# Altium schematic sheet POE_Sheet.SchDoc
size A3
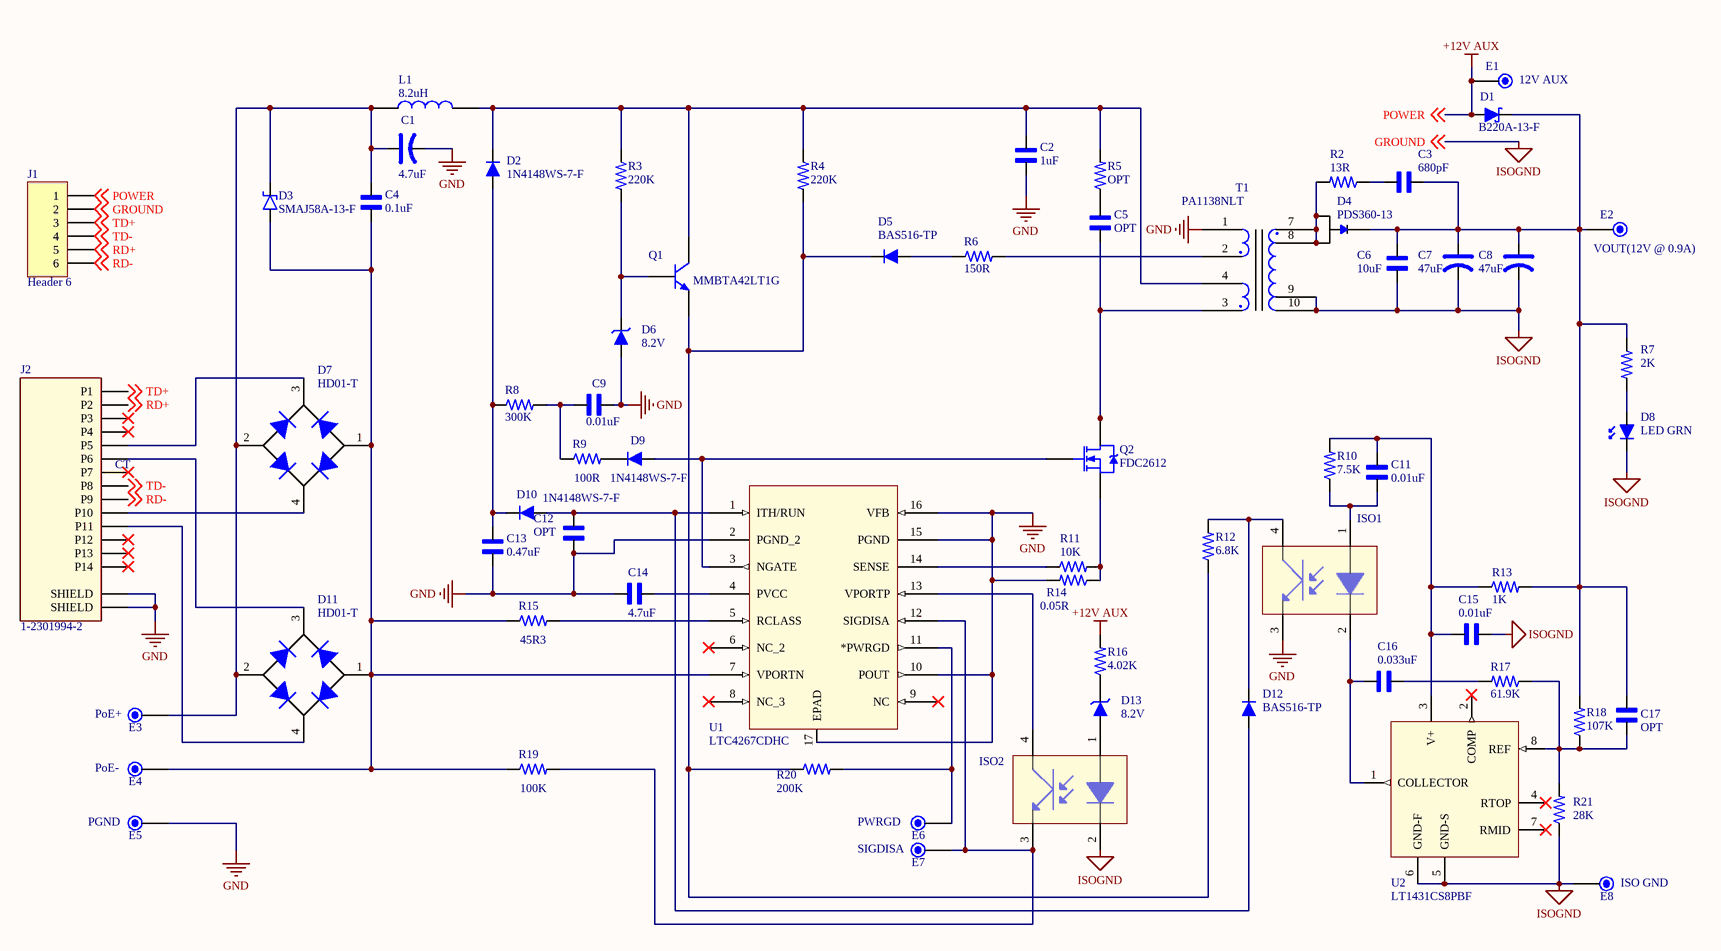
[diagram p0: POE_Sheet.SchDoc]

## Parts
C1  value 4.7uF  [CAPAE5953X52M]  (hidden comment: EMVA630ADA4R7ME55G)
C2  value 1uF  [*CAPC1005X55N]  (hidden comment: JMK105C6105KV-F)
C3  value 680pF  [*CAPC1005X55N]  (hidden comment: CC0402KRX7R9BB681)
C4  value 0.1uF  [*CAPC1005X55N]  (hidden comment: GRM155R71H104KE14J)
C5  OPT  [*CAPC1005X55N]
C6  value 10uF  [*CAPC1005X55N]  (hidden comment: GRM155R60G106ME44D)
C7  value 47uF  [CAPM6032X22N]  (hidden comment: TPSC476K016R0350)
C8  value 47uF  [CAPM6032X22N]  (hidden comment: TPSC476K016R0350)
C9  value 0.01uF  [*CAPC1005X55N]  (hidden comment: GRM155R61E103KA01D)
C11  value 0.01uF  [*CAPC1005X55N]  (hidden comment: GRM155R61E103KA01D)
C12  OPT  [*CAPC1005X55N]
C13  value 0.47uF  [*CAPC1005X55N]  (hidden comment: GRM155R61H474KE11D)
C14  value 4.7uF  [*CAPC1005X55N]  (hidden comment: GRM155R60J475ME47D)
C15  value 0.01uF  [*CAPC1005X55N]  (hidden comment: GRM155R61E103KA01D)
C16  value 0.033uF  [*CAPC1005X55N]  (hidden comment: CC0402ZRY5V7BB333)
C17  OPT  [*CAPC1005X55N]
D1  B220A-13-F  [*SMA-DIODE]
D2  1N4148WS-7-F  [*SOD323_1N4148WS-7-F(Primary)]
D3  SMAJ58A-13-F  [SMAJ]
D4  PDS360-13  [*DIO_PDS360-13]
D5  BAS516-TP  [*SOD323_1N4148WS-7-F(Primary)]
D6  value 8.2V  [*SOD323_1N4148WS-7-F(Primary)]  (hidden comment: MM3Z8V2ST1G)
D7  HD01-T  [HD01-T]
D8  value LED GRN  [LED1210]  (hidden comment: APD3224ZGC-F01)
D9  1N4148WS-7-F  [*SOD323_1N4148WS-7-F(Primary)]
D10  1N4148WS-7-F  [*SOD323_1N4148WS-7-F(Primary)]
D11  HD01-T  [HD01-T]
D12  BAS516-TP  [*SOD323_1N4148WS-7-F(Primary)]
D13  value 8.2V  [*SOD323_1N4148WS-7-F(Primary)]  (hidden comment: MM3Z8V2ST1G)
E1  12V AUX  [E_PAD]
E2  VOUT(12V @ 0.9A)  [E_PAD]
E3  PoE+  [E_PAD]
E4  PoE-  [E_PAD]
E5  PGND  [E_PAD]
E6  PWRGD  [E_PAD]
E7  SIGDISA  [E_PAD]
E8  ISO GND  [E_PAD]
ISO1  PS2913-1-K-A  [SOic254P1016X440-4N]  (value not drawn)
ISO2  PS2913-1-K-A  [SOic254P1016X440-4N]  (value not drawn)
J1  Header 6  [HDR1X6]
J2  1-2301994-2  [*TE_1-2301994-2_1-2301994-2(Primary)]
L1  value 8.2uH  [INDP6866X23N]  (hidden comment: IHLP2525CZER8R2M01)
Q1  MMBTA42LT1G  [SOT-23-3(TO-236)]
Q2  FDC2612  [*SOT95P280X100-6N]
R2  value 13R  [RESC1005X40N]  (hidden comment: RC0402FR-0713RL)
R3  value 220K  [RESC1005X40N]  (hidden comment: CRGCQ0402F220K)
R4  value 220K  [RESC1005X40N]  (hidden comment: CRGCQ0402F220K)
R5  OPT  [RESC1005X40N]
R6  value 150R  [RESC1005X40N]  (hidden comment: RC0402FR-07150RL)
R7  value 2K  [RESC1005X40N]  (hidden comment: RC0402FR-072KL)
R8  value 300K  [RESC1005X40N]  (hidden comment: RN73R1ETTP3003B25)
R9  value 100R  [RESC1005X40N]  (hidden comment: RC0402FR-07100RL)
R10  value 7.5K  [RESC1005X40N]  (hidden comment: ERA-2AEB752X)
R11  value 10K  [RESC1005X40N]  (hidden comment: RC0402FR-0710KL)
R12  value 6.8K  [RESC1005X40N]  (hidden comment: ERA-2AED682X)
R13  value 1K  [RESC1005X40N]  (hidden comment: RC0402FR-071KL)
R14  value 0.05R  [RESC1005X40N]  (hidden comment: ERJ-2BWFR050X)
R15  value 45R3  [RESC1005X40N]  (hidden comment: RP73PF1E45R3BTD)
R16  value 4.02K  [RESC1005X40N]  (hidden comment: ERA-2AEB4021X)
R17  value 61.9K  [RESC1005X40N]  (hidden comment: RMCF0402FT61K9)
R18  value 107K  [RESC1005X40N]  (hidden comment: RP73PF1E107KBTD)
R19  value 100K  [RESC1005X40N]  (hidden comment: ERA-2AEB104X)
R20  value 200K  [RESC1005X40N]  (hidden comment: CPF0402B200KE)
R21  value 28K  [RESC1005X40N]  (hidden comment: ERA-2AEB2802X)
T1  PA1138NLT  [EP13T]
U1  LTC4267CDHC  [DFN-16_DHC]
U2  LT1431CS8PBF  [*SO-8_S]

## Nets
+12V AUX: D1.1(A) E1.1 J1.1 R16.2 ; off-sheet POWER  [also labelled POWER]
GND: C1.2 C2.2 C9.1 C12.2 C13.1 C14.1 D6.A E5.1 ISO1.3 J2.SH1(SHIELD) J2.SH2(SHIELD) R14.2 T1.1 U1.2(PGND_2) U1.10(POUT) U1.15(PGND) U1.16(VFB) U1.17(EPAD)
ISOGND: C6.1 C7.2 C8.2 C15.2 D8.K E8.1 ISO2.2 J1.2 R21.1 T1.9 T1.10 U2.5(GND-S) U2.6(GND-F) ; off-sheet GROUND  [also labelled GROUND]
RD+: J1.5 J2.P2 ; off-sheet RD+
RD-: J1.6 J2.P9 ; off-sheet RD-
TD+: J1.3 J2.P1 ; off-sheet TD+
TD-: J1.4 J2.P8 ; off-sheet TD-
NetC1_1: C1.1 C4.1 D3.A D7.2 D11.2 E3.1 L1.1
NetC2_1: C2.1 D2.C L1.2 Q1.1(C) R3.1 R4.1 R5.2 T1.4
NetC3_1: C3.1 R2.1
NetC3_2: C3.2 C6.2 C7.1 C8.1 C17.2 D1.2(C) D4.3(HEATSINK_CATHODE) E2.1 R7.1 R13.2 R18.2
NetC4_2: C4.2 D3.K D7.1 D11.1 E4.1 R15.1 R19.1 U1.7(VPORTN)
NetC5_1: C5.1 R5.1
NetC5_2: C5.2 Q2.1(D) Q2.2(D) Q2.5(D) Q2.6(D) T1.3
NetC9_2: C9.2 R8.2 R9.1
NetC11_1: C11.1 ISO1.1 R10.1
NetC11_2: C11.2 C15.1 R10.2 R13.1 U2.3(V+)
NetC12_1: C12.1 D10.A D12.A U1.1(ITH/RUN)
NetC13_2: C13.2 D2.A D10.C R8.1
NetC14_2: C14.2 U1.4(PVCC)
NetC16_1: C16.1 ISO1.2 U2.1(COLLECTOR)
NetC16_2: C16.2 R17.2
NetC17_1: C17.1 R17.1 R18.1 R21.2 U2.8(REF)
NetD4_1: D4.1(LEFT_PIN_ANODE) D4.2(RIGHT_PIN_ANODE) R2.2 T1.7 T1.8
NetD5_A: D5.A R6.1
NetD5_C: D5.C Q1.3(E) R4.2 R12.1 R20.1
NetD6_C: D6.C Q1.2(B) R3.2
NetD7_3: D7.3 J2.P5
NetD7_4: D7.4 J2.P10
NetD8_A: D8.A R7.2
NetD9_A: D9.A Q2.3(G) U1.3(NGATE)
NetD9_C: D9.C R9.2
NetD11_3: D11.3 J2.P6
NetD11_4: D11.4 J2.P11
NetD12_C: D12.C ISO1.4 R12.2
NetD13_A: D13.A ISO2.1
NetD13_C: D13.C R16.1
NetE6_1: E6.1 R20.2 U1.11(*PWRGD)
NetE7_1: E7.1 ISO2.3 R19.2 U1.12(SIGDISA)
NetISO2_4: ISO2.4 U1.13(VPORTP)
NetQ2_4: Q2.4(S) R11.2 R14.1
NetR6_2: R6.2 T1.2
NetR11_1: R11.1 U1.14(SENSE)
NetR15_2: R15.2 U1.5(RCLASS)

Not connected (* = marked no-connect by the designer): J2 P3* P4* P7* P12* P13* P14*; U1 6(NC_2)* 8(NC_3)* 9(NC)*; U2 2(COMP)* 4(RTOP)* 7(RMID)*

## Notes on the sheet
- (near J2) CT

## Library data of the parts
C1 = EMVA630ADA4R7ME55G: 4.7µF 63V Aluminum Electrolytic Capacitors Radial, Can - SMD 2000 Hrs @ 85°C; MF: United Chemi-Con; SnapEDA_Link: https://www.snapeda.com/parts/EMVA630ADA4R7ME55G/United%20Chemi-Con/view-part/?ref=search&t=EMVA630ADA4R7ME55G; MP: EMVA630ADA4R7ME55G; Availability: Unavailable
C2 = JMK105C6105KV-F: 1µF ±10% 6.3V Ceramic Capacitor X6S 0402 (1005 Metric); MF: Taiyo Yuden; SnapEDA_Link: https://www.snapeda.com/parts/JMK105C6105KV-F/Taiyo%20Yuden/view-part/?ref=search&t=JMK105C6105KV-F; MP: JMK105C6105KV-F; Availability: Unavailable; Digi-Key_Part_Number: 587-3381-2-ND; Digi-Key_Purchase_URL: https://www.digikey.com.au/product-detail/en/taiyo-yuden/JMK105C6105KV-F/587-3381-2-ND/4157224
C3 = CC0402KRX7R9BB681: 680pF ±10% 50V Ceramic Capacitor X7R 0402 (1005 Metric); MF: Yageo; SnapEDA_Link: https://www.snapeda.com/parts/CC0402KRX7R9BB681/Yageo/view-part/?ref=search&t=CC0402KRX7R9BB681; MP: CC0402KRX7R9BB681; Availability: Unavailable; Digi-Key Part Number: 311-1030-2-ND
C4 = GRM155R71H104KE14J: SMD Capacitor X7R(EIA) with Capacitance: 0.10uF Tol. 10%. Rated Voltage: 50Vdc; MF: Murata Electronics; SnapEDA_Link: https://www.snapeda.com/parts/GRM155R71H104KE14J/Murata%20Electronics%20North%20America/view-part/1836262/?ref=snap; MP: GRM155R71H104KE14J; Availability: Unavailable
C5 C12 C17 = OPT_C: SnapEDA_Link: *; Value: OPT; MF: *; MP: *; Availability: Unavailable
C6 = GRM155R60G106ME44D: 10µF ±20% 4V Ceramic Capacitor X5R 0402 (1005 Metric); MF: Murata Electronics; SnapEDA_Link: https://www.snapeda.com/parts/GRM155R60G106ME44D/Murata/view-part/?ref=search&t=GRM155R60G106ME44D; MP: GRM155R60G106ME44D; Availability: Unavailable; Digi-Key Part Number: 490-10693-2-ND
C7 C8 = TPSC476K016R0350: 47µF Molded Tantalum Capacitors 16V 2312 (6032 Metric) 350mOhm; MF: AVX Corporation; SnapEDA_Link: https://www.snapeda.com/parts/TPSC476K016R0350/AVX/view-part/?ref=search&t=TPSC476K016R0350#download-modal; MP: TPSC476K016R0350; Availability: Unavailable; Digi-Key Part Number: 478-1773-2-ND
C9 C11 C15 = GRM155R61E103KA01D: 0.01uF ±10% 25V Ceramic Capacitor X5R 0402 (1005 Metric); MF: Murata Electronics; SnapEDA_Link: https://www.snapeda.com/parts/GRM155R61E103KA01D/Murata%20Electronics/view-part/?ref=search&t=GRM155R61E103KA01D; MP: GRM155R61E103KA01D; Availability: Unavailable
C13 = GRM155R61H474KE11D: 0.47µF ±10% 50V Ceramic Capacitor X5R 0402 (1005 Metric); MF: Murata Electronics; SnapEDA_Link: https://www.snapeda.com/parts/GRM155R61H474KE11D/Murata%20Electronics/view-part/?ref=search&t=GRM155R61H474KE11D; MP: GRM155R61H474KE11D; Availability: Unavailable
C14 = GRM155R60J475ME47D: 4.7µF ±20% 6.3V Ceramic Capacitor X5R 0402 (1005 Metric); MF: Murata Electronics; SnapEDA_Link: https://www.snapeda.com/parts/GRM155R60J475ME47D/Murata/view-part/?ref=search&t=GRM155R60J475ME47D; MP: GRM155R60J475ME47D; Availability: Unavailable
C16 = CC0402ZRY5V7BB333: 0.033µF -20%, +80% 16V Ceramic Capacitor Y5V (F) 0402 (1005 Metric); MF: Yageo; SnapEDA_Link: https://www.snapeda.com/parts/CC0402ZRY5V7BB333/Yageo/view-part/?ref=search&t=CC0402ZRY5V7BB333; MP: CC0402ZRY5V7BB333; Availability: Unavailable; Digi-Key Part Number: 311-1044-2-ND
D1 = B220A-13-F: Diode Schottky 20V 2A Surface Mount SMA; MF: Diodes Incorporated; SnapEDA_Link: https://www.snapeda.com/parts/B220A-13-F/Diodes%20Inc./view-part/232956/?ref=snap; Value: *; Digi-Key Part Number: B220A-FDITR-ND; MP: B220A-13-F
D2 D9 D10 = 1N4148WS-7-F: Diode Standard 75V 150mA Surface Mount SOD-323; MF: Diodes Incorporated; SnapEDA_Link: https://www.snapeda.com/parts/1N4148WS-7-F/Multicomp/view-part/957937/?ref=snap; Value: 1N4148WS-7-F; Digi-Key Part Number: 1N4148WS-FDITR-ND; MP: 1N4148WS-7-F; Digi-Key_Purchase_URL: https://www.digikey.com.au/product-detail/en/diodes-incorporated/1N4148WS-7-F/1N4148WS-FDITR-ND/815127
D3 = SMAJ58A-13-F: 93.6V Clamp 4.3A Ipp Tvs Diode Surface Mount SMA; MF: Littelfuse Inc.; MP: SMAJ58A-13-F; Package: DO-214 Littelfuse; Price: None; Value: *; SnapEDA_Link: https://www.snapeda.com/parts/SMAJ58A/Littelfuse%20Inc./view-part/53813/?ref=snap; Availability: Unavailable
D5 D12 = BAS516-TP: Diode Standard 75V 250mA (DC) Surface Mount SOD-523; Value: BAS516; MF: Micro Commercial Co; SnapEDA_Link: https://www.snapeda.com/parts/BAS516/Nexperia%20USA/view-part/?ref=search&t=BAS516-TP; Digi-Key Part Number: BAS516-TPMSTR-ND; MP: BAS516-TP; Digi-Key_Purchase_URL: https://www.digikey.com.au/product-detail/en/micro-commercial-co/BAS516-TP/BAS516-TPMSTR-ND/7681805
D6 D13 = MM3Z8V2ST1G: Zener Diode 8.2V 300mW ±2% Surface Mount SOD-323; MF: ON Semiconductor; SnapEDA_Link: https://www.snapeda.com/parts/MM3Z8V2ST1G/ON%20Semiconductor/view-part/?ref=search&t=MM3Z8V2ST1G; Digi-Key_Part_Number: MM3Z8V2ST1GOSTR-ND; Digi-Key_Purchase_URL: https://www.digikey.com.au/product-detail/en/on-semiconductor/MM3Z8V2ST1G/MM3Z8V2ST1GOSTR-ND/661874; MP: MM3Z8V2ST1G
D7 D11 = HD01-T: Bridge Rectifier Single Phase Standard 100V Surface Mount 4-MiniDIP; MF: Diodes Incorporated; Availability: Unavailable; MP: HD01-T; Package: None; Price: None; SnapEDA_Link: https://www.snapeda.com/parts/HD01-T/Diodes%20Inc./view-part/?ref=search&t=HD01-T; Value: *
D8 = APD3224ZGC-F01: Green 525nm LED Indication - Discrete 3.3V 1210 (3225 Metric); MF: Kingbright; Package: None; MP: APD3224ZGC-F01; Digi-Key_Part_Number: 754-1089-2-ND; SnapEDA_Link: https://www.snapeda.com/parts/APD3224ZGC-F01/Kingbright/view-part/?ref=search&t=APD3224ZGC-F01; Digi-Key_Purchase_URL: https://www.digikey.com.au/product-detail/en/kingbright/APD3224ZGC-F01/754-1089-2-ND/1747487
E1-E8 = E_PAD
ISO1 ISO2 = PS2913-1-K-A: Optoisolator Transistor Output 2500Vrms 1 Channel 4-Mini-Flat; MF: CEL; Value: 8.2uH; Digi-Key_Part_Number: PS2913-1-K-A-ND; MP: PS2913-1-K-A; Digi-Key_Purchase_URL: https://www.digikey.com.au/product-detail/en/cel/PS2913-1-K-A/PS2913-1-K-A-ND/2614692; SnapEDA_Link: https://www.snapeda.com/parts/PS2913-1-K-A/CEL/view-part/?ref=search&t=ps2913-1-k-a#download-modal
J1 = Header 6: Header, 6-Pin; LatestRevisionDate: 17-Jul-2002; LatestRevisionNote: Re-released for DXP Platform.; Publisher: Altium Limited
L1 = IHLP2525CZER8R2M01: 8.2µH Shielded Molded Inductor 4A 68mOhm Max Nonstandard; MF: Vishay Dale; Availability: Unavailable; MP: IHLP2525CZER8R2M01; Package: None; Price: None; SnapEDA_Link: https://www.snapeda.com/parts/IHLP2525CZER8R2M01/Vishay%20Dale/view-part/?ref=search&t=IHLP2525CZER8R2M01
Q1 = MMBTA42LT1G: Bipolar (BJT) Transistor NPN 300V 500mA 50MHz 225mW Surface Mount SOT-23-3 (TO-236); MF: ON Semiconductor; Value: MMBTA42LT1G; SnapEDA_Link: https://www.snapeda.com/parts/MMBTA42LT1G/ON%20Semiconductor/view-part/?ref=search&t=MMBTA42LT1G; MP: MMBTA42LT1G; Digi-Key_Part_Number: MMBTA42LT1GOSTR-ND; Digi-Key_Purchase_URL: https://www.digikey.com.au/product-detail/en/on-semiconductor/MMBTA42LT1G/MMBTA42LT1GOSTR-ND/919627
Q2 = FDC2612: N-Channel 200V 1.1A (Ta) 1.6W (Ta) Surface Mount SuperSOT™-6; MF: ON Semiconductor; SnapEDA_Link: https://www.snapeda.com/parts/FDC2612/ON%20Semiconductor/view-part/?ref=search&t=FDC2612; Digi-Key_Purchase_URL: https://www.digikey.com.au/product-detail/en/on-semiconductor/FDC2612/FDC2612TR-ND/979778; Digi-Key Part Number: FDC2612TR-ND; MP: FDC2612; Value: FDC2612; ComponentLink1Description: Manufacturer Link; ComponentLink1URL: http://www.irf.com/
R2 = RC0402FR-0713RL: 13 Ohms ±1% 0.063W, 1/16W Chip Resistor 0402 (1005 Metric) Moisture Resistant Thick Film; MF: Yageo; Package: none; MP: RC0402FR-0713RL; Digi-Key_Part_Number: YAG2977TR-ND; SnapEDA_Link: https://www.snapeda.com/parts/RC0402FR-0713RL/Yageo/view-part/?ref=search&t=RC0402FR-0713RL; Digi-Key_Purchase_URL: https://www.digikey.com.au/product-detail/en/yageo/RC0402FR-0713RL/YAG2977TR-ND/5280837
R3 R4 = CRGCQ0402F220K: 220 kOhms ±1% 0.063W, 1/16W Chip Resistor 0402 (1005 Metric) Automotive AEC-Q200, Moisture Resistant Thick Film; MF: TE Connectivity Passive Product; Package: None; MP: CRGCQ0402F220K; Digi-Key_Part_Number: A129655TR-ND; SnapEDA_Link: https://www.snapeda.com/parts/CRGCQ0402F220K/TE%20Connectivity/view-part/?ref=search&t=CRGCQ0402F220K; Digi-Key_Purchase_URL: https://www.digikey.com.au/product-detail/en/te-connectivity-passive-product/CRGCQ0402F220K/A129655TR-ND/8576257
R5 = OPT_R: Package: none; MP: *; Digi-Key_Part_Number: *; SnapEDA_Link: *; MF: *; Digi-Key_Purchase_URL: *; Value: OPT
R6 = RC0402FR-07150RL: 150 Ohms ±1% 0.063W, 1/16W Chip Resistor 0402 (1005 Metric) Moisture Resistant Thick Film; MF: Yageo; Package: none; MP: RC0402FR-07150RL; Digi-Key_Part_Number: 311-150LRTR-ND; SnapEDA_Link: https://www.snapeda.com/parts/RC0402FR-07150RL/Yageo/view-part/?ref=search&t=RC0402FR-07150RL; Digi-Key_Purchase_URL: https://www.digikey.com.au/product-detail/en/yageo/RC0402FR-07150RL/311-150LRTR-ND/726543
R7 = RC0402FR-072KL: 2 kOhms ±1% 0.063W, 1/16W Chip Resistor 0402 (1005 Metric) Moisture Resistant Thick Film; MF: Yageo; Package: None; MP: RC0402FR-072KL; Digi-Key_Part_Number: 311-2KLRTR-ND; SnapEDA_Link: https://www.snapeda.com/parts/RC0402FR-072KL/Yageo/view-part/?ref=search&t=RC0402FR-072KL; Digi-Key_Purchase_URL: https://www.digikey.com.au/product-detail/en/yageo/RC0402FR-072KL/311-2KLRTR-ND/2827565
R8 = RN73R1ETTP3003B25: 300 kOhms ±0.1% 0.063W, 1/16W Chip Resistor 0402 (1005 Metric) Moisture Resistant Metal Film; MF: KOA Speer Electronics, Inc.; Package: None; MP: RN73R1ETTP3003B25; Digi-Key_Part_Number: 2019-RN73R1ETTP3003B25TR-ND; SnapEDA_Link: https://www.snapeda.com/parts/RN73R1ETTP3003B25/KOA%20Speer%20Electronics,%20Inc./view-part/?ref=search&t=RN73R1ETTP3003B25; Digi-Key_Purchase_URL: https://www.digikey.com.au/product-detail/en/koa-speer-electronics-inc/RN73R1ETTP3003B25/2019-RN73R1ETTP3003B25TR-ND/10003541
R9 = RC0402FR-07100RL: 100 Ohms ±1% 0.063W, 1/16W Chip Resistor 0402 (1005 Metric) Moisture Resistant Thick Film; MF: Yageo; Package: None; MP: RC0402FR-07100RL; Digi-Key_Part_Number: 311-100LRTR-ND; SnapEDA_Link: https://www.snapeda.com/parts/RC0402FR-07100RL/Yageo/view-part/?ref=search&t=RC0402FR-07100RL; Digi-Key_Purchase_URL: https://www.digikey.com.au/product-detail/en/yageo/RC0402FR-07100RL/311-100LRTR-ND/726527
R10 = ERA-2AEB752X: 7.5 kOhms ±0.1% 0.063W, 1/16W Chip Resistor 0402 (1005 Metric) Automotive AEC-Q200 Thin Film; MF: Panasonic Electronic Components; Package: None; MP: ERA-2AEB752X; Digi-Key_Part_Number: P7.5KDCTR-ND; SnapEDA_Link: https://www.snapeda.com/parts/ERA-2AEB752X/Panasonic/view-part/?ref=search&t=ERA-2AEB752X; Digi-Key_Purchase_URL: https://www.digikey.com.au/product-detail/en/panasonic-electronic-components/ERA-2AEB752X/P7-5KDCTR-ND/1706026
R11 = RC0402FR-0710KL: 10 kOhms ±1% 0.063W, 1/16W Chip Resistor 0402 (1005 Metric) Moisture Resistant Thick Film; MF: Yageo; Package: None; MP: RC0402FR-0710KL; Digi-Key_Part_Number: 311-10.0KLRTR-ND; SnapEDA_Link: https://www.snapeda.com/parts/RC0402FR-0710KL/Yageo/view-part/?ref=search&t=RC0402FR-0710KL; Digi-Key_Purchase_URL: https://www.digikey.com.au/product-detail/en/yageo/RC0402FR-0710KL/311-10-0KLRTR-ND/726523
R12 = ERA-2AED682X: 6.8 kOhms ±0.5% 0.063W, 1/16W Chip Resistor 0402 (1005 Metric) Automotive AEC-Q200 Thin Film; MF: Panasonic Electronic Components; Package: none; MP: ERA-2AED682X; Digi-Key_Part_Number: P6.8KDETR-ND; SnapEDA_Link: https://www.snapeda.com/parts/ERA-2AED682X/Panasonic/view-part/?ref=search&t=ERA-2AED682X; Digi-Key_Purchase_URL: https://www.digikey.com.au/product-detail/en/panasonic-electronic-components/ERA-2AED682X/P6-8KDETR-ND/1706122
R13 = RC0402FR-071KL: 1 kOhms ±1% 0.063W, 1/16W Chip Resistor 0402 (1005 Metric) Moisture Resistant Thick Film; MF: Yageo; Package: None; MP: RC0402FR-071KL; Digi-Key_Part_Number: 311-1.00KLRTR-ND; SnapEDA_Link: https://www.snapeda.com/parts/RC0402FR-071KL/Yageo/view-part/?ref=search&t=RC0402FR-071KL; Digi-Key_Purchase_URL: https://www.digikey.com.au/product-detail/en/yageo/RC0402FR-071KL/311-1-00KLRTR-ND/726513
R14 = ERJ-2BWFR050X: 50 mOhms ±1% 0.25W, 1/4W Chip Resistor 0402 (1005 Metric) Automotive AEC-Q200, Current Sense Thick Film; MF: Panasonic Electronic Components; Package: None; MP: ERJ-2BWFR050X; Digi-Key_Part_Number: P17367TR-ND; SnapEDA_Link: https://www.snapeda.com/parts/ERJ-2BWFR050X/Panasonic%20Electronic/view-part/?ref=search&t=ERJ-2BWFR050X; Digi-Key_Purchase_URL: https://www.digikey.com.au/product-detail/en/panasonic-electronic-components/ERJ-2BWFR050X/P17367TR-ND/5647400
R15 = RP73PF1E45R3BTD: Fixed Resistor RP 1E 0.1W 45R3 0.1% 25PPM 5K RL; MF: TE Connectivity Passive Product; Package: None; MP: RP73PF1E45R3BTD; Digi-Key_Part_Number: A127190TR-ND; SnapEDA_Link: https://www.snapeda.com/parts/RP73PF1E45R3BTD/TE%20Connectivity/view-part/?ref=search&t=RP73PF1E45R3BTD; Digi-Key_Purchase_URL: https://www.digikey.com.au/product-detail/en/te-connectivity-passive-product/RP73PF1E45R3BTD/A127190TR-ND/8260732
R16 = ERA-2AEB4021X: 4.02 kOhms ±0.1% 0.063W, 1/16W Chip Resistor 0402 (1005 Metric) Automotive AEC-Q200 Thin Film; MF: Panasonic Electronic Components; Package: None; MP: ERA-2AEB4021X; Digi-Key_Part_Number: P4.02KDCTR-ND; SnapEDA_Link: https://www.snapeda.com/parts/ERA-2AEB4021X/Panasonic%20Electronic/view-part/?ref=search&t=ERA-2AEB4021X; Digi-Key_Purchase_URL: https://www.digikey.com.au/product-detail/en/panasonic-electronic-components/ERA-2AEB4021X/P4-02KDCTR-ND/2026107
R17 = RMCF0402FT61K9: 61.9 kOhms ±1% 0.063W, 1/16W Chip Resistor 0402 (1005 Metric) Automotive AEC-Q200 Thick Film; MF: Stackpole Electronics Inc; Package: None; MP: RMCF0402FT61K9; Digi-Key_Part_Number: RMCF0402FT61K9TR-ND; SnapEDA_Link: https://www.snapeda.com/parts/RMCF0402FT61K9/Stackpole%20Electronics%20Inc/view-part/?ref=search&t=RMCF0402FT61K9; Digi-Key_Purchase_URL: https://www.digikey.com.au/product-detail/en/stackpole-electronics-inc/RMCF0402FT61K9/RMCF0402FT61K9TR-ND/1761731
R18 = RP73PF1E107KBTD: 107 kOhms ±0.1% 0.1W, 1/10W Chip Resistor 0402 (1005 Metric) Thin Film; MF: TE Connectivity Passive Product; Package: None; MP: RP73PF1E107KBTD; Digi-Key_Part_Number: A127514TR-ND; SnapEDA_Link: https://www.snapeda.com/parts/RP73PF1E107KBTD/TE%20Connectivity/view-part/?ref=search&t=RP73PF1E107KBTD; Digi-Key_Purchase_URL: https://www.digikey.com.au/product-detail/en/te-connectivity-passive-product/RP73PF1E107KBTD/A127514TR-ND/8261056
R19 = ERA-2AEB104X: 100 kOhms Â±0.1% 0.063W, 1/16W Chip Resistor 0402 _1005 Metric_ Automotive AEC-Q200 Thin Film; MF: Panasonic Electronic; Package: 1005 Panasonic Electronic Components; MP: ERA-2AEB104X; Digi-Key_Part_Number: P100KDCCT-ND; SnapEDA_Link: https://www.snapeda.com/parts/ERA-2AEB104X/Panasonic%20Electronic%20Components/view-part/419877/?ref=snap; Digi-Key_Purchase_URL: https://www.digikey.com/product-detail/en/panasonic-electronic-components/ERA-2AEB104X/P100KDCCT-ND/1706231?utm_source=snapeda&utm_medium=aggregator&utm_campaign=symbol
R20 = CPF0402B200KE: 200 kOhms ±0.1% 0.063W, 1/16W Chip Resistor 0402 (1005 Metric) Thin Film; MF: TE Connectivity Passive Product; Package: none; MP: CPF0402B200KE; Digi-Key_Part_Number: A119933TR-ND; SnapEDA_Link: https://www.snapeda.com/parts/CPF0402B200KE/TE%20Connectivity/view-part/?ref=search&t=CPF0402B200KE; Digi-Key_Purchase_URL: https://www.digikey.com.au/product-detail/en/te-connectivity-passive-product/CPF0402B200KE/A119933TR-ND/4966463
R21 = ERA-2AEB2802X: 28 kOhms ±0.1% 0.063W, 1/16W Chip Resistor 0402 (1005 Metric) Automotive AEC-Q200 Thin Film; MF: Panasonic Electronic Components; Package: None; MP: ERA-2AEB2802X; Digi-Key_Part_Number: P28KDCTR-ND; SnapEDA_Link: https://www.snapeda.com/parts/ERA-2AEB2802X/Panasonic/view-part/?ref=search&t=ERA-2AEB2802X; Digi-Key_Purchase_URL: https://www.digikey.com.au/product-detail/en/panasonic-electronic-components/ERA-2AEB2802X/P28KDCTR-ND/2026182
T1 = PA1138NLT: 127µH Isolation and Data Interface (Encapsulated) Pulse Transformer 1:0.292:0.208 Surface Mount; MF: Pulse Electronics Power; Package: None; MP: PA1138NLT; Digi-Key_Part_Number: 553-1984-1-ND; SnapEDA_Link: https://www.snapeda.com/parts/PA1138NLT/Pulse%20Electronics/view-part/?ref=search&t=PA1138NLT; Digi-Key_Purchase_URL: https://www.digikey.com.au/product-detail/en/pulse-electronics-power/PA1138NLT/553-1984-1-ND/3179343; Value: PA1138NL
U1 = LTC4267CDHC: Power Switch ICs - POE / LAN LTC4267 - Power over Ethernet IEEE 802.3af PD Interface with Integrated Switching Regulator; MF: Analog Devices / Linear Technology; Price: None; Availability: Unavailable; Package: None; SnapEDA_Link: https://www.snapeda.com/parts/LTC4267CDHC/Analog%20Devices/view-part/4219202/?ref=snap; MP: LTC4267CDHC; Value: *
U2 = LT1431CS8PBF: Shunt Voltage Reference IC 36V ±0.4% 8-SOIC; MF: Linear Technology/Analog Devices; MP: LT1431CS8#PBF; SnapEDA_Link: https://www.snapeda.com/parts/LT1431CS8%23PBF/Analog%20Devices/view-part/4342248/?ref=snap; Value: LT1431CS8PBF; Digi-Key Part Number: LT1431CS8#PBF-ND
D4 = PDS360-13: SnapEDA_Link: https://www.snapeda.com/parts/PDS360-13/Diodes%20Inc./view-part/110877/?ref=snap; Value: *
J2 = 1-2301994-2: SnapEDA_Link: https://www.snapeda.com/parts/1-2301994-2/TE%20Connectivity%20AMP%20Connectors/view-part/1504817/?ref=snap; Value: *